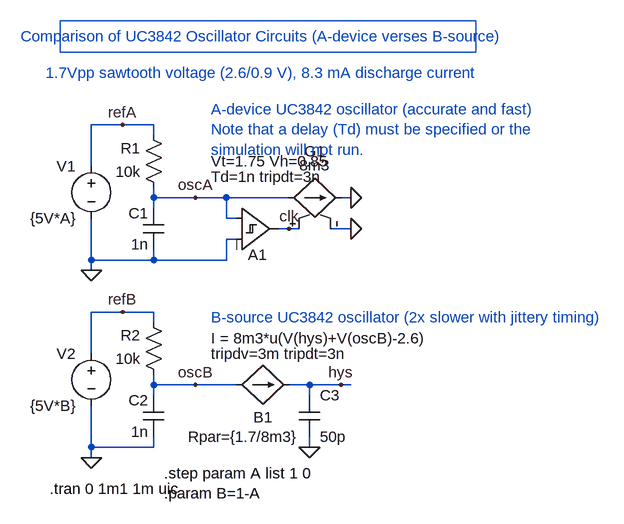
[diagram p0: schematic oscillatorABtest.asc]
oscillatorABtest.asc, the LTspice schematic file:
Version 4
SHEET 1 1296 680
WIRE 512 48 464 48
WIRE 560 48 512 48
WIRE 560 64 560 48
WIRE 464 112 464 48
WIRE 560 160 560 144
WIRE 624 160 560 160
WIRE 672 160 624 160
WIRE 768 160 672 160
WIRE 864 160 848 160
WIRE 560 176 560 160
WIRE 672 192 672 160
WIRE 688 192 672 192
WIRE 768 208 752 208
WIRE 784 208 768 208
WIRE 864 208 832 208
WIRE 688 224 672 224
WIRE 464 256 464 192
WIRE 560 256 560 240
WIRE 560 256 464 256
WIRE 672 256 672 224
WIRE 672 256 560 256
WIRE 464 272 464 256
WIRE 512 336 464 336
WIRE 560 336 512 336
WIRE 560 352 560 336
WIRE 464 400 464 336
WIRE 560 448 560 432
WIRE 624 448 560 448
WIRE 688 448 624 448
WIRE 800 448 768 448
WIRE 848 448 800 448
WIRE 864 448 848 448
WIRE 560 464 560 448
WIRE 800 464 800 448
WIRE 464 544 464 480
WIRE 560 544 560 528
WIRE 560 544 464 544
WIRE 800 544 800 528
WIRE 464 560 464 544
FLAG 624 160 oscA
FLAG 464 272 0
FLAG 512 48 refA
FLAG 624 448 oscB
FLAG 464 560 0
FLAG 512 336 refB
FLAG 864 208 0
FLAG 864 160 0
FLAG 768 208 clk
FLAG 848 448 hys
FLAG 800 544 0
SYMBOL voltage 464 96 M0
SYMATTR InstName V1
SYMATTR Value {5V*A}
SYMBOL res 576 160 R180
WINDOW 0 36 76 Left 0
WINDOW 3 36 40 Left 0
SYMATTR InstName R1
SYMATTR Value 10k
SYMBOL cap 576 176 M0
SYMATTR InstName C1
SYMATTR Value 1n
SYMBOL voltage 464 384 M0
SYMATTR InstName V2
SYMATTR Value {5V*B}
SYMBOL res 576 448 R180
WINDOW 0 36 76 Left 0
WINDOW 3 36 40 Left 0
SYMATTR InstName R2
SYMATTR Value 10k
SYMBOL cap 576 464 M0
SYMATTR InstName C2
SYMATTR Value 1n
SYMBOL Digital\\diffschmtbuf 688 144 R0
WINDOW 0 32 88 Top 0
WINDOW 3 -40 -40 Left 0
WINDOW 123 -40 -16 Left 0
SYMATTR InstName A1
SYMATTR Value Vt=1.75 Vh=0.85
SYMATTR Value2 Td=1n tripdt=3n
SYMBOL g2 864 160 M270
WINDOW 0 56 56 VTop 0
WINDOW 3 34 56 VTop 0
SYMATTR InstName G1
SYMATTR Value 8m3
SYMBOL bi 688 448 R270
WINDOW 0 -34 40 VBottom 0
WINDOW 3 72 -40 VRight 0
WINDOW 123 48 -40 VRight 0
SYMATTR InstName B1
SYMATTR Value I = 8m3*u(V(hys)+V(oscB)-2.6)
SYMATTR Value2 tripdv=3m tripdt=3n
SYMBOL cap 784 464 R0
WINDOW 0 32 0 Left 0
WINDOW 3 32 64 Left 0
WINDOW 39 0 64 Right 0
SYMATTR InstName C3
SYMATTR Value 50p
SYMATTR SpiceLine Rpar={1.7/8m3}
TEXT 728 -32 Center 0 ;1.7Vpp sawtooth voltage (2.6/0.9 V), 8.3 mA discharge current
TEXT 648 24 Left 0 ;A-device UC3842 oscillator (accurate and fast)\nNote that a delay (Td) must be specified or the \nsimulation will not run.
TEXT 648 344 Left 0 ;B-source UC3842 oscillator (2x slower with jittery timing)
TEXT 400 608 Left 0 !.tran 0 1m1 1m uic
TEXT 576 584 Left 0 !.step param A list 1 0\n.param B=1-A
TEXT 728 -88 Center 0 ;Comparison of UC3842 Oscillator Circuits (A-device verses B-source)
RECTANGLE Normal 1056 -64 416 -112

The netlist it stands for:
* oscillatorABtest.asc
V1 refA 0 {5V*A}
R1 oscA refA 10k
C1 oscA 0 1n
V2 refB 0 {5V*B}
R2 oscB refB 10k
C2 oscB 0 1n
A1 oscA 0 0 0 0 0 clk 0 SCHMITT Vt=1.75 Vh=0.85 Td=1n tripdt=3n
G1 oscA 0 clk 0 8m3
B1 oscB hys I = 8m3*u(V(hys)+V(oscB)-2.6) tripdv=3m tripdt=3n
C3 hys 0 50p Rpar={1.7/8m3}
* 1.7Vpp sawtooth voltage (2.6/0.9 V), 8.3 mA discharge current
* A-device UC3842 oscillator (accurate and fast)
* Note that a delay (Td) must be specified or the
* simulation will not run.
* B-source UC3842 oscillator (2x slower with jittery timing)
.tran 0 1m1 1m uic
.step param A list 1 0
.param B=1-A
* Comparison of UC3842 Oscillator Circuits (A-device verses B-source)
.backanno
.end